# EAGLE board motherboard (EAGLE 5.10), part 1 of 3
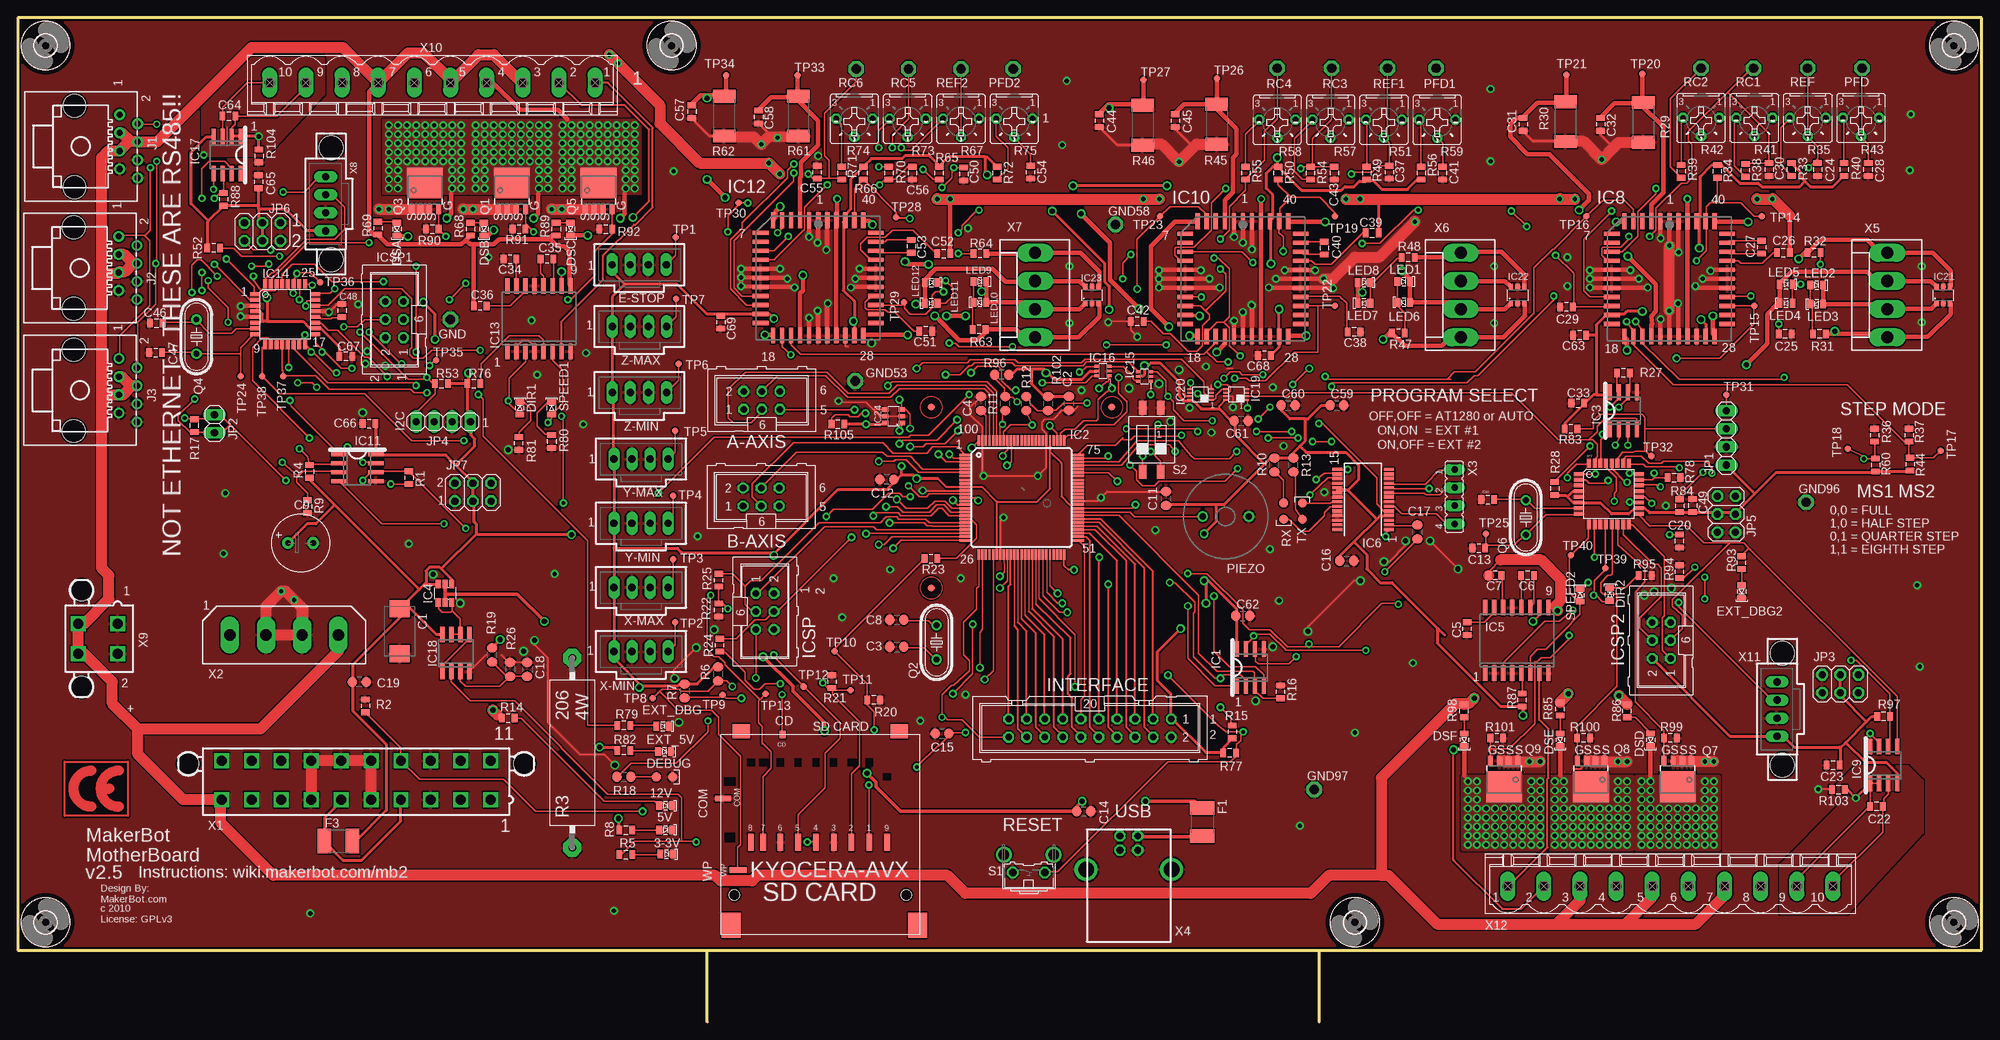
[diagram p7: board, top side]
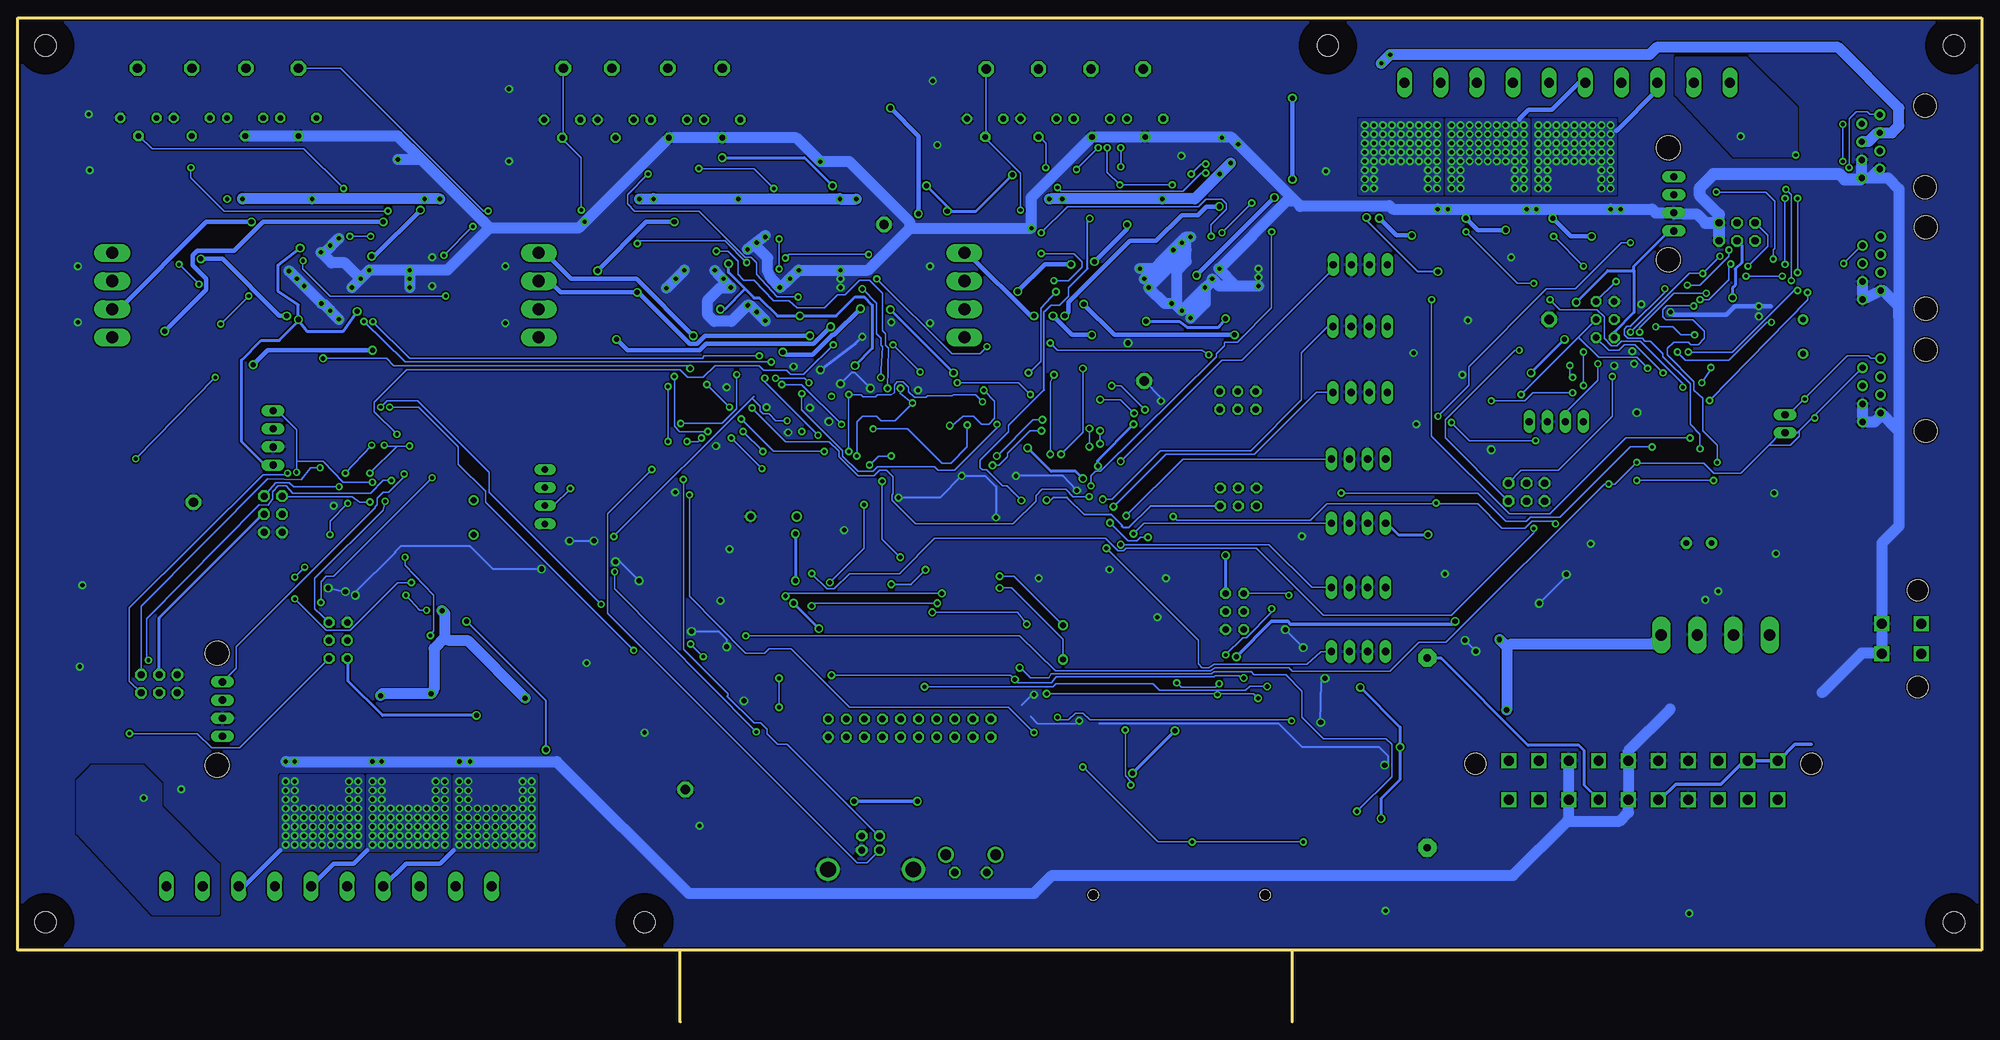
[diagram p8: board, bottom side, seen from below]

Size 276 x 141.1 mm. Coordinates in mm from the lower left corner, seen from the top.
Outline: 96.9,0 96.9,10
Outline: 182.9,0 182.9,10
Outline: 0,10.1 276,10.1 276,141.1 0,141.1 0,10.1
Copper layers (1*16): Top 0.035mm / dielectric 1.5mm / Bottom 0.035mm
Design rules "SparkFun *": minimum track width 8mil, minimum drill 20mil, track to track 8mil, track to pad 6mil, pad to pad 6mil, via to via 8mil, smd to smd 6mil, copper to edge 10mil, drill to drill 8mil, minimum pad ring 12mil, minimum via ring 10mil, stop-mask expansion 4mil, vias tented up to drill 25mil, thermal gap 10mil
Net classes: 0 default: width 0.152 mm, drill 0.406 mm, clearance 0.203 mm; 1 power: width 0.61 mm, drill 0.711 mm, clearance 0.203 mm; 2 gnd: width 0.305 mm, drill 0.711 mm, clearance 0.203 mm; 3 usbvcc: width 0.508 mm, drill 0.711 mm, clearance 0.203 mm; 4 5V_power: width 0.406 mm, drill 0.711 mm, clearance 0.203 mm; 5 12V_power: width 1.524 mm, drill 0.711 mm, clearance 0.203 mm

## Footprints (pad centres in the part's own frame; a part is rotated, then mirrored left to right if it is on the bottom)
LED-0805 = smd 1.2 x 0.8: A 0,-0.9; C 0,0.9
ML6 = drill 0.914 octagon: 1 -2.54,-1.27; 2 -2.54,1.27; 3 0,-1.27; 4 0,1.27; 5 2.54,-1.27; 6 2.54,1.27
SMC_D = smd 2.4 x 2.8: + -3.15,0; - 3.15,0
C0805RND = smd 1.3 x 1.5: 1 -0.977,0; 2 0.977,0
0805 = smd 0.8 x 1.2: 1 -0.9,0; 2 0.9,0
E3,5-8 = drill 0.813 pad 1.6 round: + -1.778,0 | drill 0.813 pad 1.6 octagon: - 1.778,0
0805RND = smd 1.27 x 1.27: P$1 -1.143,0; P$2 1.143,0
70543-04 = drill 1.016 long: 1 -3.81,0; 2 -1.27,0; 3 1.27,0; 4 3.81,0
L1812 = smd 1.9 x 3.4: 1 -1.95,0; 2 1.95,0
P1-13 = drill 1.321 pad 2.159 octagon: TP 0,0
SO08 = smd 0.6 x 2.2: 1 -1.905,-2.6; 2 -0.635,-2.6; 3 0.635,-2.6; 4 1.905,-2.6; 5 1.905,2.6; 6 0.635,2.6; 7 -0.635,2.6; 8 -1.905,2.6
TQFP100 = smd 1.5 x 0.35: 1 -8,6; 2 -8,5.5; 3 -8,5; 4 -8,4.5; 5 -8,4; 6 -8,3.5; 7 -8,3; 8 -8,2.5; 9 -8,2; 10 -8,1.5; 11 -8,1; 12 -8,0.5; 13 -8,0; 14 -8,-0.5; 15 -8,-1; 16 -8,-1.5; 17 -8,-2; 18 -8,-2.5; 19 -8,-3; 20 -8,-3.5; 21 -8,-4; 22 -8,-4.5; 23 -8,-5; 24 -8,-5.5; 25 -8,-6; 51 8,-6; 52 8,-5.5; 53 8,-5; 54 8,-4.5; 55 8,-4; 56 8,-3.5; 57 8,-3; 58 8,-2.5; 59 8,-2; 60 8,-1.5; 61 8,-1; 62 8,-0.5; 63 8,0; 64 8,0.5; 65 8,1; 66 8,1.5; 67 8,2; 68 8,2.5; 69 8,3; 70 8,3.5; 71 8,4; 72 8,4.5; 73 8,5; 74 8,5.5; 75 8,6 | smd 0.35 x 1.5: 26 -6,-8; 27 -5.5,-8; 28 -5,-8; 29 -4.5,-8; 30 -4,-8; 31 -3.5,-8; 32 -3,-8; 33 -2.5,-8; 34 -2,-8; 35 -1.5,-8; 36 -1,-8; 37 -0.5,-8; 38 0,-8; 39 0.5,-8; 40 1,-8; 41 1.5,-8; 42 2,-8; 43 2.5,-8; 44 3,-8; 45 3.5,-8; 46 4,-8; 47 4.5,-8; 48 5,-8; 49 5.5,-8; 50 6,-8; 76 6,8; 77 5.5,8; 78 5,8; 79 4.5,8; 80 4,8; 81 3.5,8; 82 3,8; 83 2.5,8; 84 2,8; 85 1.5,8; 86 1,8; 87 0.5,8; 88 0,8; 89 -0.5,8; 90 -1,8; 91 -1.5,8; 92 -2,8; 93 -2.5,8; 94 -3,8; 95 -3.5,8; 96 -4,8; 97 -4.5,8; 98 -5,8; 99 -5.5,8; 100 -6,8
FDC6304 = smd 0.7 x 1.2: 1 -0.95,-1.3; 2 0,-1.3; 3 0.95,-1.3; 4 0.95,1.3; 5 0,1.3; 6 -0.95,1.3
SO16W = smd 0.6 x 2.2: 1 -4.445,-4.6; 2 -3.175,-4.6; 3 -1.905,-4.6; 4 -0.635,-4.6; 5 0.635,-4.6; 6 1.905,-4.6; 7 3.175,-4.6; 8 4.445,-4.6; 9 4.445,4.6; 10 3.175,4.6; 11 1.905,4.6; 12 0.635,4.6; 13 -0.635,4.6; 14 -1.905,4.6; 15 -3.175,4.6; 16 -4.445,4.6
SSOP28 = smd 0.381 x 1.499: 1 -4.225,-3.625; 2 -3.575,-3.625; 3 -2.925,-3.625; 4 -2.275,-3.625; 5 -1.625,-3.625; 6 -0.975,-3.625; 7 -0.325,-3.625; 8 0.325,-3.625; 9 0.975,-3.625; 10 1.625,-3.625; 11 2.275,-3.625; 12 2.925,-3.625; 13 3.575,-3.625; 14 4.225,-3.625; 15 4.225,3.625; 16 3.575,3.625; 17 2.925,3.625; 18 2.275,3.625; 19 1.625,3.625; 20 0.975,3.625; 21 0.325,3.625; 22 -0.325,3.625; 23 -0.975,3.625; 24 -1.625,3.625; 25 -2.275,3.625; 26 -2.925,3.625; 27 -3.575,3.625; 28 -4.225,3.625
TQFP32-08 = smd 1.27 x 0.559: 1 -4.293,2.8; 2 -4.293,2; 3 -4.293,1.2; 4 -4.293,0.4; 5 -4.293,-0.4; 6 -4.293,-1.2; 7 -4.293,-2; 8 -4.293,-2.8; 17 4.293,-2.8; 18 4.293,-2; 19 4.293,-1.2; 20 4.293,-0.4; 21 4.293,0.4; 22 4.293,1.2; 23 4.293,2; 24 4.293,2.8 | smd 0.559 x 1.27: 9 -2.8,-4.293; 10 -2,-4.293; 11 -1.2,-4.293; 12 -0.4,-4.293; 13 0.4,-4.293; 14 1.2,-4.293; 15 2,-4.293; 16 2.8,-4.293; 25 2.8,4.293; 26 2,4.293; 27 1.2,4.293; 28 0.4,4.293; 29 -0.4,4.293; 30 -1.2,4.293; 31 -2,4.293; 32 -2.8,4.293
PLCC44 = smd 0.6 x 2.2: 1 0,8.1; 2 -1.27,8.1; 3 -2.54,8.1; 4 -3.81,8.1; 5 -5.08,8.1; 6 -6.35,8.1; 18 -6.35,-8.1; 19 -5.08,-8.1; 20 -3.81,-8.1; 21 -2.54,-8.1; 22 -1.27,-8.1; 23 0,-8.1; 24 1.27,-8.1; 25 2.54,-8.1; 26 3.81,-8.1; 27 5.08,-8.1; 28 6.35,-8.1; 40 6.35,8.1; 41 5.08,8.1; 42 3.81,8.1; 43 2.54,8.1; 44 1.27,8.1 | smd 2.2 x 0.6: 7 -8.1,6.35; 8 -8.1,5.08; 9 -8.1,3.81; 10 -8.1,2.54; 11 -8.1,1.27; 12 -8.1,0; 13 -8.1,-1.27; 14 -8.1,-2.54; 15 -8.1,-3.81; 16 -8.1,-5.08; 17 -8.1,-6.35; 29 8.1,-6.35; 30 8.1,-5.08; 31 8.1,-3.81; 32 8.1,-2.54; 33 8.1,-1.27; 34 8.1,0; 35 8.1,1.27; 36 8.1,2.54; 37 8.1,3.81; 38 8.1,5.08; 39 8.1,6.35
SC70-6 = smd 0.4 x 0.7: 1 -0.65,-0.85; 2 0,-0.85; 3 0.65,-0.85; 4 0.65,0.85; 5 0,0.85; 6 -0.65,0.85
DCU_R-PDSO-G8 = smd 0.3 x 0.6: 1 -0.75,-1.5; 2 -0.25,-1.5; 3 0.25,-1.5; 4 0.75,-1.5; 5 0.75,1.5; 6 0.25,1.5; 7 -0.25,1.5; 8 -0.75,1.5
SOT23-6 = smd 0.6 x 0.9: 1 -0.95,-1.15; 2 0,-1.15; 3 0.95,-1.15; 4 0.95,1.15; 5 0,1.15; 6 -0.95,1.15
ML20 = drill 0.914 octagon: 1 -11.43,-1.27; 2 -11.43,1.27; 3 -8.89,-1.27; 4 -8.89,1.27; 5 -6.35,-1.27; 6 -6.35,1.27; 7 -3.81,-1.27; 8 -3.81,1.27; 9 -1.27,-1.27; 10 -1.27,1.27; 11 1.27,-1.27; 12 1.27,1.27; 13 3.81,-1.27; 14 3.81,1.27; 15 6.35,-1.27; 16 6.35,1.27; 17 8.89,-1.27; 18 8.89,1.27; 19 11.43,-1.27; 20 11.43,1.27
556416-1 = drill 0.889 round: 1 -4.445,5.461; 2 -3.175,8.001; 3 -1.905,5.461; 4 -0.635,8.001; 5 0.635,5.461; 6 1.905,8.001; 7 3.175,5.461; 8 4.445,8.001 | hole 3.251: -5.715,-0.889; 5.715,-0.889
KYOCERA-SDCARD = smd 0.8 x 2.4: 1 -6.88,1.2; 2 -4.38,1.2; 3 -1.88,1.2; 4 0.62,1.2; 5 3.12,1.2; 6 5.62,1.2; 7 8.05,1.2; 8 9.75,1.2; 9 -9.38,1.2 | smd 0.8 x 1.05: CD 5.3,-13.9 | smd 2.7 x 3.5: CGND1 12.55,12.85; CGND2 -13.65,12.85 | smd 2.4 x 2: CGND3 -11.1,-14.4; CGND4 11.1,-14.4 | smd 2.25 x 0.8: COM 13.68,-4.95 | smd 2.4 x 0.8: WP 11.573,5.1 | hole 1.5: 12.1,8.6; -12.1,8.6
1X04 = drill 1.016 long: 1 -3.81,0; 2 -1.27,0; 3 1.27,0; 4 3.81,0
1X02 = drill 1.016 long: 1 -1.27,0; 2 1.27,0
2X03 = drill 1.016 octagon: 1 -2.54,-1.27; 2 -2.54,1.27; 3 0,-1.27; 4 0,1.27; 5 2.54,-1.27; 6 2.54,1.27
BUZZER-12MM-NS = drill 0.9 round: + 3.25,0; - -3.25,0
SOT669 = smd 0.7 x 1.4: 1 -1.905,-2.65; 2 -0.635,-2.65; 3 0.635,-2.65; 4 1.905,-2.65 | smd 5 x 4.3: MB 0,1
HC49/S = drill 0.813 round: 1 -2.413,0; 2 2.413,0
KH206-8 = drill 1.016 pad 2.54 octagon: 1 -13.335,0; 2 13.335,0
R0805RND = smd 1.3 x 1.5: 1 -0.977,0; 2 0.977,0
R2512 = smd 1.8 x 3.2: 1 -2.8,0; 2 2.8,0
B25P = drill 0.813 octagon: A -2.54,0; E 2.54,0; S 0,2.54
B3F-31XX = drill 1.016 octagon: 1 -2.261,-1.245; 2 2.261,-1.245 | drill 1.499 pad 2.159 round: 3 -3.505,1.245; 4 3.505,1.245
SMS-002 = smd 1.092 x 2.007: 1 -1.27,-4.496; 2 1.27,-4.496; 3 1.27,4.496; 4 -1.27,4.496
TP09R = smd 0.9 x 0.9: TP 0,0
3,0 = hole 3: 0,0
FIDUCIA-MOUNT = smd 1.016 x 1.016: P$1 0,0
5566-20 = drill 1.4 square: 1 18.9,-2.75; 2 14.7,-2.75; 3 10.5,-2.75; 4 6.3,-2.75; 5 2.1,-2.75; 6 -2.1,-2.75; 7 -6.3,-2.75; 8 -10.5,-2.75; 9 -14.7,-2.75; 10 -18.9,-2.75; 11 18.9,2.75; 12 14.7,2.75; 13 10.5,2.75; 14 6.3,2.75; 15 2.1,2.75; 16 -2.1,2.75; 17 -6.3,2.75; 18 -10.5,2.75; 19 -14.7,2.75; 20 -18.9,2.75 | hole 3: 23.6,2.29; -23.6,2.29
9090-4V = drill 1.6 pad 2.6 long: 1 -7.62,0; 2 -2.54,0; 3 2.54,0; 4 7.62,0
JP4 = drill 0.914 long: 1 -3.81,0; 2 -1.27,0; 3 1.27,0; 4 3.81,0
PN61729 = drill 0.95 octagon: 1 1.25,4.71; 2 -1.25,4.71; 3 -1.25,2.71; 4 1.25,2.71 | drill 2.2 round: P$1 -6,0; P$2 6,0
KK-156-4 = drill 1.7 pad 2.184 long: 1 -5.94,0; 2 -1.98,0; 3 1.98,0; 4 5.94,0
70543-04' = drill 1.016 long: 1 -3.81,0; 2 -1.27,0; 3 1.27,0; 4 3.81,0 | hole 3.404: -7.874,-0.762; 7.874,-0.762
5566-4 = drill 1.4 square: 1 2.1,-2.75; 2 -2.1,-2.75; 3 2.1,2.75; 4 -2.1,2.75 | hole 3: 6.8,2.29; -6.8,2.29
MSTBV10 = drill 1.397 long: 1 -22.86,0; 2 -17.78,0; 3 -12.7,0; 4 -7.62,0; 5 -2.54,0; 6 2.54,0; 7 7.62,0; 8 12.7,0; 9 17.78,0; 10 22.86,0

## Placement (x,y rotation side)
3-3V  [LED-0805]  91.18,23.59 270 top
5V  [LED-0805]  91.04,27.01 270 top
12V  [LED-0805]  91.04,30.41 270 top
A-AXIS  [ML6]  104.56,87.35 0 top
B-AXIS  [ML6]  104.47,73.77 0 top
C1  100u  [SMC_D]  53.68,54.89 270 top
C2  100n  [C0805RND]  147.71,86.95 270 top
C3  22p  [C0805RND]  123.53,52.71 0 top
C4  100n  [C0805RND]  135.34,86.9 90 top
C5  .22uF  [0805]  203.67,55.27 90 top
C6  100nF  [0805]  212.18,62.77 180 top
C7  100nF  [0805]  207.61,62.77 180 top
C8  22p  [C0805RND]  123.53,56.52 0 top
C9  100uF  [E3,5-8]  39.74,67.31 0 top
C10  16pf  [0805]  206.59,73.44 0 top
C11  100n  [C0805RND]  161.38,73.56 90 top
C12  100n  [C0805RND]  122.14,76.23 180 top
C13  16pf  [0805]  205.32,66.58 0 top
C14  100n  [C0805RND]  149.82,29.62 0 top
C15  100n  [C0805RND]  129.88,40.54 0 top
C16  100n  [C0805RND]  186.78,64.8 0 top
C17  100n  [C0805RND]  196.69,68.86 270 top
C18  100n  [C0805RND]  71.59,49.56 270 top
C19  100n  [C0805RND]  47.99,47.78 180 top
C20  100nF  [0805]  233.52,67.59 90 top
C22  100nF  [0805]  261.2,30.26 180 top
C23  100nF  [0805]  255.11,36.1 0 top
C24  100nF  [0805]  252.95,119.79 270 top
C25  220nF  [0805]  248.38,96.68 180 top
C26  220nF  [0805]  248.12,108.11 0 top
C27  220nF  [0805]  245.07,108.87 270 top
C28  100nF  [0805]  260.06,119.79 90 top
C29  470pF  [0805]  217.64,100.49 180 top
C30  470pF  [0805]  246.09,119.79 270 top
C31  1uF  [0805]  211.55,126.14 270 top
C32  1uF  [0805]  222.47,126.14 270 top
C33  100nF  [0805]  219.24,86.95 0 top
C34  .22uF  [0805]  69.18,107.22 0 top
C35  100nF  [0805]  74.39,107.22 180 top
C36  100nF  [0805]  64.99,100.61 180 top
C37  100nF  [0805]  192.75,119.41 270 top
C38  220nF  [0805]  187.8,96.93 180 top
C39  220nF  [0805]  190.34,110.9 0 top
C40  220nF  [0805]  183.61,108.74 270 top
C41  100nF  [0805]  200.24,119.28 90 top
C42  470pF  [0805]  157.32,98.45 180 top
C43  470pF  [0805]  185,119.28 270 top
C44  1uF  [0805]  151.98,126.65 270 top
C45  1uF  [0805]  162.65,126.65 270 top
C46  16pf  [0805]  19.47,98.23 0 top
C47  16pf  [0805]  19.37,94.06 0 top
C48  100nF  [0805]  45.56,99.98 270 top
C49  100nF  [0805]  235.34,72.57 270 top
C50  100nF  [0805]  132.93,119.16 270 top
C51  220nF  [0805]  127.6,97.06 180 top
C52  220nF  [0805]  130.14,107.98 0 top
C53  220nF  [0805]  125.57,109 270 top
C54  100nF  [0805]  142.33,119.41 90 top
C55  470pF  [0805]  112.36,119.41 90 top
C56  470pF  [0805]  125.69,119.28 270 top
C57  1uF  [0805]  94.71,127.92 270 top
C58  1uF  [0805]  104.1,127.16 270 top
C59  100n  [C0805RND]  185.38,86.64 0 top
C60  100n  [C0805RND]  178.53,86.64 0 top
C61  100n  [C0805RND]  171.92,84.48 0 top
C62  100n  [C0805RND]  172.15,57.08 0 top
C63  100nF  [0805]  219.5,96.5 180 top
C64  100nF  [0805]  29.68,127.28 0 top
C65  100nF  [0805]  33.85,118.06 270 top
C66  100nF  [0805]  49.37,84.1 0 top
C67  100nF  [0805]  46.11,93.5 180 top
C68  100nF  [0805]  175.2,93.65 180 top
C69  100nF  [0805]  98.79,98.33 270 top
DEBUG  [0805RND]  90.9,34.45 0 top
DIR1  [LED-0805]  70.58,86.26 0 top
DIR2  [LED-0805]  223.74,60.1 0 top
DSA  [LED-0805]  53.3,111.41 180 top
DSB  [LED-0805]  65.5,111.41 180 top
DSC  [LED-0805]  77.69,111.41 180 top
DSD  [LED-0805]  229.45,39.65 180 top
DSE  [LED-0805]  216.75,39.65 180 top
DSF  [LED-0805]  203.29,39.65 180 top
E-STOP  C-GRID-04-70543  [70543-04]  87.33,106.41 0 top
EXT_5V  [LED-0805]  90.9,38 270 top
EXT_DBG  [LED-0805]  90.64,41.56 270 top
EXT_DBG2  [LED-0805]  242.28,60.48 180 top
F1  500mA  [L1812]  166.46,28.1 270 top
F3  500mA  [L1812]  45.05,25.43 0 top
GND  TPPAD1-13  [P1-13]  60.8,98.71 0 top
GND53  TPPAD1-13  [P1-13]  117.69,90.07 0 top
GND58  TPPAD1-13  [P1-13]  154.27,112.04 0 top
GND96  TPPAD1-13  [P1-13]  251.3,73.03 0 top
GND97  TPPAD1-13  [P1-13]  182.21,32.69 0 top
IC1  SN75176ASOIC  [SO08]  173.24,49.8 0 top
IC2  ATMEGA1280-16AU  [TQFP100]  141.06,73.69 0 top
IC3  SN75176ASOIC  [SO08]  225.64,85.88 0 top
IC4  [FDC6304]  60.03,60.23 0 top
IC5  A3949  [SO16W]  210.66,53.62 0 top
IC6  FT232RL  [SSOP28]  189.07,73.44 90 top
IC7  ATMEGA328  [TQFP32-08]  223.61,74.2 0 top
IC8  A3977  [PLCC44]  232.12,104.42 0 top
IC9  MAX6675  [SO08]  262.22,36.1 0 top
IC10  A3977  [PLCC44]  172.18,104.42 0 top
IC11  SN75176ASOIC  [SO08]  47.71,77.88 270 top
IC12  A3977  [PLCC44]  112.48,104.55 0 top
IC13  A3949  [SO16W]  73.24,98.84 0 top
IC14  ATMEGA328  [TQFP32-08]  37.55,99.47 0 top
IC15  741G19  [SC70-6]  158.33,90.71 90 top
IC16  741G19  [SC70-6]  152.49,91.47 90 top
IC17  MAX6675  [SO08]  29.43,121.82 180 top
IC18  LM358MX  [SO08]  61.56,51.85 0 top
IC19  74LVC2G157  [DCU_R-PDSO-G8]  171.24,88.17 90 top
IC20  74LVC2G157  [DCU_R-PDSO-G8]  166.21,88.17 90 top
IC21  TVS-DIODE-ARRAY  [SOT23-6]  270.6,102.14 0 top
IC22  TVS-DIODE-ARRAY  [SOT23-6]  210.78,102.14 0 top
IC23  TVS-DIODE-ARRAY  [SOT23-6]  150.97,102.14 0 top
IC24  24LC014  [SOT23-6]  123.08,85.12 90 top
ICSP  [ML6]  104.99,57.69 270 top
ICSP1  [ML6]  52.92,98.71 90 top
ICSP2  [ML6]  230.98,53.62 90 top
INTERFACE  [ML20]  150.67,41.31 180 top
J1  [556416-1]  8.85,123.04 270 top
J2  [556416-1]  8.73,105.95 270 top
J3  [556416-1]  8.74,88.76 270 top
J4  SDCARD-AVX  [KYOCERA-SDCARD]  112.78,26.47 180 top
JP1  [1X04]  240.12,82.07 90 top
JP2  [1X02]  27.64,84.06 270 top
JP3  [2X03]  256.12,47.53 0 top
JP4  [1X04]  59.78,84.36 180 top
JP5  [2X03]  240.12,71.35 90 top
JP6  [2X03]  34.38,111.03 180 top
JP7  [2X03]  63.97,74.45 0 top
LED1  A  [LED-0805]  194.78,104.04 270 top
LED2  A  [LED-0805]  252.82,103.53 270 top
LED3  B  [LED-0805]  252.82,100.87 90 top
LED4  C  [LED-0805]  248.5,101 90 top
LED5  D  [LED-0805]  248.5,103.66 270 top
LED6  B  [LED-0805]  194.78,101.12 90 top
LED7  C  [LED-0805]  189.19,101 90 top
LED8  D  [LED-0805]  189.19,103.92 270 top
LED9  A  [LED-0805]  135.22,104.04 270 top
LED10  B  [LED-0805]  135.22,101.12 90 top
LED11  C  [LED-0805]  128.36,101 90 top
LED12  D  [LED-0805]  128.36,103.92 270 top
PFD  TPPAD1-13  [P1-13]  259.17,134.01 180 top
PFD1  TPPAD1-13  [P1-13]  199.35,134.01 0 top
PFD2  TPPAD1-13  [P1-13]  139.92,133.89 180 top
PIEZO  BUZZERNS  [BUZZER-12MM-NS]  169.76,71.02 180 top
Q1  PH7030L  [SOT669]  69.43,116.87 0 top
Q2  16MHz  [HC49/S]  129.12,53.34 90 top
Q3  PH7030L  [SOT669]  57.24,116.87 0 top
Q4  16MHZ  [HC49/S]  25.11,96.3 90 top
Q5  PH7030L  [SOT669]  81.62,116.87 0 top
Q6  16MHZ  [HC49/S]  211.93,70.9 90 top
Q7  PH7030L  [SOT669]  233.26,34.07 180 top
Q8  PH7030L  [SOT669]  221.07,34.07 180 top
Q9  PH7030L  [SOT669]  208.88,34.07 180 top
R1  180  [0805]  54.95,76.48 270 top
R2  1K  [0805]  48.85,44.43 270 top
R3  30  [KH206-8]  77.93,37.83 90 top
R4  4.7k  [0805]  40.98,77.37 270 top
R5  1K  [0805]  85.45,23.57 0 top
R6  10k  [R0805RND]  98.39,48.92 270 top
R7  10k  [R0805RND]  93.69,46.51 270 top
R8  1K  [0805]  85.43,26.95 0 top
R9  4.7k  [0805]  40.73,72.42 270 top
R10  1k  [R0805RND]  176.62,78.26 90 top
R11  1K  [R0805RND]  138.77,86.9 90 top
R12  1K  [R0805RND]  141.72,86.9 90 top
R13  1k  [R0805RND]  179.29,78.26 90 top
R14  2.2K  [0805]  68.92,42.7 0 top
R15  10K  [0805]  170.7,40.79 270 top
R16  10K  [0805]  177.46,46.4 90 top
R17  180  [0805]  24.84,83.8 90 top
R18  1K  [R0805RND]  85.18,34.45 0 top
R19  10k  [R0805RND]  66.64,51.59 90 top
R20  3.3K  [0805]  120.28,45.23 180 top
R21  3.3K  [0805]  114.4,47.83 270 top
R22  3.3K  [0805]  98.5,57.9 90 top
R23  1.8K  [0805]  128.34,65.12 0 top
R24  1.8K  [0805]  98.63,52.94 90 top
R25  1.8K  [0805]  98.5,62.09 90 top
R26  10k  [R0805RND]  69.18,49.56 270 top
R27  180  [0805]  225.64,91.22 180 top
R28  4.7k  [0805]  215.99,74.96 270 top
R29  0.25  [R2512]  228.44,126.39 270 top
R30  0.25  [R2512]  217.51,126.52 270 top
R31  1K  [0805]  253.2,96.68 180 top
R32  1K  [0805]  252.44,108.11 0 top
R33  12K  [0805]  249.26,119.79 90 top
R34  1K  [0805]  238.85,119.54 90 top
R35  47K  [B25P]  251.55,127.03 180 top
R36  10K  [0805]  260.95,82.45 270 top
R37  10K  [0805]  265.77,82.45 270 top
R38  12K  [0805]  242.79,119.66 90 top
R39  12K  [0805]  233.77,119.54 270 top
R40  12K  [0805]  256.63,119.79 270 top
R41  47K  [B25P]  244.06,127.03 180 top
R42  47K  [B25P]  236.56,127.03 180 top
R43  47K  [B25P]  259.04,127.03 180 top
R44  0  [0805]  265.9,78.39 270 top
R45  0.25  [R2512]  168.49,126.14 270 top
R46  0.25  [R2512]  158.08,126.01 270 top
R47  1K  [0805]  194.02,96.8 0 top
R48  1K  [0805]  195.39,107.42 180 top
R49  12K  [0805]  189.57,119.28 270 top
R50  1K  [0805]  177.13,119.28 90 top
R51  47K  [B25P]  191.99,126.78 180 top
R52  4.7K  [0805]  27.52,108.74 180 top
R53  4.7K  [0805]  59.53,89.69 0 top
R54  12K  [0805]  181.7,119.28 90 top
R55  12K  [0805]  172.56,119.28 270 top
R56  12K  [0805]  197.19,119.28 270 top
R57  47K  [B25P]  184.49,126.78 180 top
R58  47K  [B25P]  177,126.78 180 top
R59  47K  [B25P]  199.48,126.78 180 top
R60  0  [0805]  261.07,78.26 270 top
R61  0.25  [R2512]  109.69,127.28 270 top
R62  0.25  [R2512]  99.28,127.28 270 top
R63  1K  [0805]  135.09,97.31 180 top
R64  1K  [0805]  135.22,107.98 180 top
R65  12K  [0805]  129.5,119.28 90 top
R66  1K  [0805]  118.84,119.28 90 top
R67  47K  [B25P]  132.55,126.9 180 top
R68  1K  [0805]  63.59,111.41 270 top
R69  1K  [0805]  50.64,111.54 270 top
R70  12K  [0805]  122.39,119.28 270 top
R71  12K  [0805]  115.79,119.28 270 top
R72  12K  [0805]  137.63,119.28 90 top
R73  47K  [B25P]  125.06,126.9 180 top
R74  47K  [B25P]  117.57,126.9 180 top
R75  47K  [B25P]  140.04,126.9 180 top
R76  10K  [0805]  64.1,89.69 0 top
R77  1K  [0805]  170.32,37.83 180 top
R78  4.7k  [0805]  232.75,76.48 0 top
R79  1K  [0805]  85.18,41.69 180 top
R80  1K  [0805]  75.02,81.56 270 top
R81  1K  [0805]  70.45,81.31 90 top
R82  1K  [0805]  85.18,38.13 180 top
R83  4.7K  [0805]  218.28,83.34 180 top
R84  4.7K  [0805]  233.52,72.55 270 top
R85  1K  [0805]  216.75,43.97 90 top
R86  1K  [0805]  226.15,43.72 90 top
R87  10K  [0805]  211.42,45.24 90 top
R88  10K  [0805]  28.92,115.6 270 top
R89  1K  [0805]  75.66,111.41 270 top
R90  4.7K  [0805]  58.26,111.41 0 top
R91  4.7K  [0805]  70.45,111.41 0 top
R92  4.7K  [0805]  82.64,111.41 0 top
R93  1K  [0805]  242.28,64.55 90 top
R94  1K  [0805]  233.52,63.28 90 top
R95  1K  [0805]  228.69,62.77 180 top
R96  10k  [R0805RND]  138.27,90.96 180 top
R97  10K  [0805]  262.22,42.96 180 top
R98  1K  [0805]  203.29,43.72 90 top
R99  4.7K  [0805]  232.25,39.91 180 top
R100  4.7K  [0805]  220.05,39.91 180 top
R101  4.7K  [0805]  207.86,39.91 180 top
R102  10k  [R0805RND]  144.77,86.9 270 top
R103  0  [0805]  255.87,32.69 0 top
R104  0  [0805]  33.87,121.7 270 top
R105  1.8K  [0805]  115.25,84 0 top
RC1  TPPAD1-13  [P1-13]  243.93,134.01 180 top
RC2  TPPAD1-13  [P1-13]  236.56,134.01 180 top
RC3  TPPAD1-13  [P1-13]  184.62,134.01 0 top
RC4  TPPAD1-13  [P1-13]  177,134.01 0 top
RC5  TPPAD1-13  [P1-13]  125.19,133.89 180 top
RC6  TPPAD1-13  [P1-13]  117.82,133.89 180 top
REF  TPPAD1-13  [P1-13]  251.55,134.01 180 top
REF1  TPPAD1-13  [P1-13]  192.5,134.01 0 top
REF2  TPPAD1-13  [P1-13]  132.55,133.89 180 top
RX  [0805RND]  177.89,71.78 270 top
S1  [B3F-31XX]  142.08,22.26 0 top
S2  SWS002  [SMS-002]  159.35,81.82 180 top
SPEED1  1  [LED-0805]  75.02,86.26 0 top
SPEED2  1  [LED-0805]  219.55,59.97 0 top
TP1  TPSQTP09R  [TP09R]  92.47,110.25 0 top
TP2  TPSQTP09R  [TP09R]  92.34,56.15 180 top
TP3  TPSQTP09R  [TP09R]  92.08,65.04 180 top
TP4  TPSQTP09R  [TP09R]  92.08,73.93 180 top
TP5  TPSQTP09R  [TP09R]  92.34,83.08 180 top
TP6  TPSQTP09R  [TP09R]  92.85,92.47 180 top
TP7  TPSQTP09R  [TP09R]  92.5,101.64 0 top
TP8  TPSQTP09R  [TP09R]  89.18,45.48 90 top
TP9  TPSQTP09R  [TP09R]  99.02,46 180 top
TP10  TPSQTP09R  [TP09R]  114.77,52.1 0 top
TP11  TPSQTP09R  [TP09R]  117.06,46.64 0 top
TP12  TPSQTP09R  [TP09R]  110.45,47.15 180 top
TP13  TPSQTP09R  [TP09R]  105.12,46.13 180 top
TP14  PTR1TP09R  [TP09R]  245.07,113.19 90 top
TP15  PTR1TP09R  [TP09R]  244.06,100.61 90 top
TP16  PTR1TP09R  [TP09R]  220.44,113.19 180 top
TP17  PTR1TP09R  [TP09R]  270.22,80.29 90 top
TP18  PTR1TP09R  [TP09R]  257.16,80.57 90 top
TP19  PTR1TP09R  [TP09R]  185.13,113.19 180 top
TP20  PTR1TP09R  [TP09R]  228.31,133.25 0 top
TP21  PTR1TP09R  [TP09R]  217.64,133.13 90 top
TP22  PTR1TP09R  [TP09R]  185.13,100.61 90 top
TP23  PTR1TP09R  [TP09R]  160.49,113.19 180 top
TP24  PTR1TP09R  [TP09R]  31.33,90.71 180 top
TP25  PTR1TP09R  [TP09R]  206.34,68.61 90 top
TP26  PTR1TP09R  [TP09R]  168.49,132.62 0 top
TP27  PTR1TP09R  [TP09R]  158.21,132.36 0 top
TP28  PTR1TP09R  [TP09R]  123.41,113.06 0 top
TP29  PTR1TP09R  [TP09R]  124.55,101.12 90 top
TP30  PTR1TP09R  [TP09R]  101.31,115.09 180 top
TP31  PTR1TP09R  [TP09R]  240.12,88.17 0 top
TP32  PTR1TP09R  [TP09R]  229.58,79.53 0 top
TP33  PTR1TP09R  [TP09R]  109.56,133 0 top
TP34  PTR1TP09R  [TP09R]  99.53,133 180 top
TP35  PTR1TP09R  [TP09R]  58.76,92.99 0 top
TP36  PTR1TP09R  [TP09R]  42.51,103.92 0 top
TP37  PTR1TP09R  [TP09R]  37.3,90.71 0 top
TP38  PTR1TP09R  [TP09R]  34.38,90.71 0 top
TP39  PTR1TP09R  [TP09R]  223.1,63.78 0 top
TP40  PTR1TP09R  [TP09R]  218.28,65.56 0 top
TX  [0805RND]  180.53,71.78 90 top
U$1  [3,0]  187.9,14 0 top
U$3  FIDUCIALMOUNT  [FIDUCIA-MOUNT]  128.36,60.99 0 top
U$4  [3,0]  3.9,137.2 0 top
U$5  [3,0]  272.1,137.2 0 top
U$6  [3,0]  272.1,14 0 top
U$7  [3,0]  3.9,14 0 top
U$8  FIDUCIALMOUNT  [FIDUCIA-MOUNT]  153.76,86.39 0 top
U$9  FIDUCIALMOUNT  [FIDUCIA-MOUNT]  128.36,86.39 0 top
U$10  CE  [CE-COPPER]  6.57,28.99 0 top
U$11  [3,0]  91.9,137.2 0 top
X1  5566-20  [5566-20]  47.54,33.99 0 top
X2  9090-4V  [9090-4V]  37.43,54.39 0 top
X3  [JP4]  201.89,73.82 270 top
X4  [PN61729]  156.14,21.44 0 top
X5  [KK-156-4]  262.73,102.14 90 top
X6  [KK-156-4]  202.78,102.14 90 top
X7  [KK-156-4]  142.97,102.14 90 top
X8  C-GRID-04-70543  [70543-04']  43.27,114.97 90 top
X9  5566-4  [5566-4]  11.27,53.88 90 top
X10  MSTBV10  [MSTBV10]  58.26,131.98 180 top
X11  C-GRID-04-70543  [70543-04']  247.23,43.97 90 top
X12  MSTBV10  [MSTBV10]  232.25,19.08 0 top
X-MAX  C-GRID-04-70543  [70543-04]  87.58,61.07 0 top
X-MIN  C-GRID-04-70543  [70543-04]  87.58,52.05 0 top
Y-MAX  C-GRID-04-70543  [70543-04]  87.58,79.11 0 top
Y-MIN  C-GRID-04-70543  [70543-04]  87.58,70.09 0 top
Z-MAX  C-GRID-04-70543  [70543-04]  87.35,97.74 0 top
Z-MIN  C-GRID-04-70543  [70543-04]  87.35,88.47 0 top

## Tracks (layer width: path | path; a pad name or v marks a point on that pad's centre or on a via)
3V3  (via drill 0.51)
  Top 0.203: 93.31,25.43 86.7,25.43 84.93,23.65 84.67,23.65 R5.1 | 93.31,25.43 95.21,25.43 v95.34,25.3 | IC18.2 60.92,47.78 63.59,45.11 69.81,45.11 82.89,32.03 92.8,32.03 93.31,31.53 93.31,25.43 | v181.6,74.07 184.11,76.48 185.38,76.48 IC6.17 | 131.28,40.67 131.03,40.67 130.9,40.54 C15.2 131.28,40.67 | 131.28,40.67 v133.19,40.67 | 129.44,38.83 129.38,38.77 | 129.44,38.83 131.28,40.67 | v110.96,25.3 112.1,25.3 J4.4 | v126.33,35.84 129.38,38.89 129.44,38.83
  Bottom 0.203: v181.6,74.07 181.6,59.85 173.7,51.85 171.03,51.85 170.4,52.48 167.35,52.48 159.09,44.23 136.74,44.23 v133.19,40.67 | v95.34,25.3 v110.96,25.3 115.79,25.3 v126.33,35.84
+5V  (via drill 0.6 pad 0, 0.71)
  Top 0.305: 129.27,76.38 130.47,75.19 IC2.10 135.5,75.19 137.56,73.13 137.56,73.03 | 137.56,73.03 IC2.31 | IC2.61 147.8,72.69 146.65,73.84 146.65,78.57 145.07,80.14 145.07,81.68 IC2.80 145.07,81.69 145.07,74.96 143.24,73.13 137.66,73.13 137.56,73.03 | 168.87,86.14 168.87,86.56 IC19.8 | IC20.8 165.05,87.42 165.19,87.28 | v134.08,80.67 134.08,80.7 IC2.100
  Top 0.406: v166.08,99.22 164.3,99.22 164.17,99.34 IC10.16 | v177.25,100.16 IC10.27 177.25,94.81 C68.1 | R56.2 197.19,118.39 196.69,118.39 195.29,117 191.73,117 190.46,118.27 189.57,118.27 R49.2 189.45,118.14 188.56,118.14 187.8,117.38 186.53,117.38 186.02,116.87 180.43,116.87 177.25,120.05 R50.2 | R50.2 176.37,120.17 175.48,119.28 175.48,117.12 176.37,116.23 176.37,112.93 175.99,112.55 IC10.42 176.11,112.42 v176.11,106.53 | 158.59,91.98 159.22,92.61 160.49,92.61 163.16,89.95 163.16,88.04 163.79,87.28 165.19,87.28 166.33,86.14 168.87,86.14 170.52,84.48 C61.1 171.03,84.36 171.03,82.58 175.22,78.39 | 158.59,91.98 158.33,91.72 158.33,90.96 158.08,90.71 IC15.5 | 185.51,74.71 185.51,74.96 IC6.19 | 185.51,74.71 185.51,74.45 IC6.20 | 187.8,67.47 185.76,65.44 185.76,64.8 C16.1 | 190.97,70.64 187.8,67.47 | 190.97,70.64 191.48,71.15 192.62,71.15 IC6.4 | 186.91,74.71 185.51,74.71 | 186.91,74.71 190.97,70.64 | R15.2 170.65,39.78 169.51,38.64 169.51,37.88 R77.2 169.25,37.88 166.97,37.88 162.14,42.7 INTERFACE.1 162.02,42.83 162.02,46.13 160.11,48.04 160.11,51.97 v163.41,55.27 | 180.94,84.74 181.32,84.74 183.22,86.64 C59.1 | 180.94,84.74 178.78,84.74 177.64,85.88 177.64,86.64 C60.1 | 168.37,72.67 169.51,72.67 175.22,78.39 | 168.37,72.67 161.38,72.67 C11.1 | 175.22,78.39 175.99,79.15 176.62,79.15 R10.2 176.75,79.28 179.29,79.28 R13.2 178.91,79.41 178.91,79.66 180.18,80.93 | 171.29,57.05 171.29,58.07 167.35,62.01 v166.71,62.01 166.97,61.88 v166.97,58.83 | 171.29,57.05 171.29,52.48 IC1.8 | v166.71,68.61 168.37,70.26 168.37,72.67 | 180.18,80.93 180.94,81.69 180.94,84.74 | 186.91,74.71 188.43,76.23 188.43,78.26 186.65,80.04 181.06,80.04 180.18,80.93
  Top 0.406: 187.8,67.47 189.57,65.69 189.57,63.66 191.48,61.75 193.13,61.75 199.61,55.27 | v158.33,92.23 158.59,91.98 | 220.25,86.96 221.45,88.17 221.83,88.17 | 220.25,86.96 217.39,84.1 R83.2 | 221.83,88.17 223.74,88.17 IC3.8 | 221.83,96.5 221.83,97.95 223.23,99.34 IC8.16 224.12,99.47 225.77,99.47 226.15,99.85 v228.31,99.85 | 221.83,96.5 221.83,88.17 | 251.17,118.14 251.93,117.38 255.11,117.38 256.63,118.9 R40.2 | 251.17,118.14 250.53,118.78 250.53,119.41 R33.2 | 236.18,112.81 235.93,112.55 IC8.42 | 236.18,112.81 236.44,113.06 236.44,118.78 238.09,120.43 238.85,120.43 R34.2 238.98,120.55 239.36,120.55 242.03,117.89 244.56,117.89 245.07,117.38 250.41,117.38 251.17,118.14 | v236.56,98.71 237.2,98.07 IC8.27 | v236.31,108.74 236.31,112.68 236.18,112.81 | JP3.4 JP3.3 256.25,46.13 256.25,45.75 259.81,42.19 | 256.12,38.51 256.12,36.1 C23.2 | 259.81,42.19 260.57,42.96 R97.2 | 256.88,39.27 259.81,42.19 | 256.12,38.51 256.88,39.27 | IC9.4 264.12,34.95 262.6,36.48 259.68,36.48 256.88,39.27 | ICSP2.2 240.63,40.16 X11.1 247.36,40.03 248.25,40.03 249.65,38.64 256,38.64 256.12,38.51 | 217.77,73.82 218.66,72.93 219.29,72.93 IC7.6 219.42,72.93 222.47,72.93 223.99,71.4 226.4,71.4 227.29,72.29 227.8,72.29 IC7.18 227.93,72.17 228.69,72.17 229.33,71.53 233.39,71.53 R84.2 233.52,71.53 235.42,71.53 | 217.77,73.82 217.64,73.94 215.99,73.94 R28.2 | IC7.4 219.29,74.58 218.53,74.58 217.77,73.82 | 235.42,71.53 238.72,71.53 JP5.4 238.98,71.53 241.26,71.53 JP5.3 241.52,71.66 244.12,74.26 | R44.2 265.9,77.37 261.07,77.37 R60.2 260.95,77.25 247.11,77.25 244.12,74.26 | 244.12,74.26 JP1.1 | v211.55,43.08 211.55,44.23 R87.1 211.42,44.35 208.37,44.35 199.48,53.24 199.48,55.15 199.61,55.27
  Top 0.406: 34.38,98.58 34.13,98.33 33.36,98.33 IC14.6 | 34.38,98.58 34.38,99.47 33.87,99.98 33.49,99.98 33.36,99.85 IC14.4 | C67.2 45.17,93.5 45.17,94.9 42.51,97.57 41.87,97.57 IC14.18 41.75,97.57 40.98,97.57 40.09,98.45 35.02,98.45 | 35.02,98.45 34.51,98.45 34.38,98.58 | 33.87,114.2 33.87,112.81 JP6.3 JP6.4 | 33.87,114.2 33.87,114.71 | 33.87,114.71 33.87,117.12 C65.2 | 26.76,112.55 R88.2 29.05,114.71 33.87,114.71 | 26.76,112.55 26.63,112.42 26.63,108.74 R52.2 | IC17.4 27.52,124.36 26.51,124.36 24.35,122.2 24.35,114.97 26.76,112.55 | v35.02,101.76 35.02,98.45 | X8.1 40.73,111.16 37.68,114.2 33.87,114.2 | R76.1 R53.2 | R76.1 63.21,89.56 63.21,84.74 JP4.1 63.72,84.23 63.72,82.45 64.23,81.94 64.23,80.93 61.56,78.26 | C66.2 50.38,84.1 50.38,79.79 IC11.8 50.51,79.66 60.16,79.66 61.56,78.26 | 61.56,78.26 63.97,75.85 JP7.4 JP7.3 64.1,73.06 64.1,70.26 64.48,69.88 64.48,68.61 | 57.37,61.5 57.11,61.5 56.41,60.8 | 57.37,61.5 59.02,61.5 IC4.6 | 56.41,60.8 53.68,58.07 C1.+ | 59.53,63.66 59.27,63.91 57.88,63.91 57.37,63.4 57.37,61.5 | 59.53,63.66 60.92,62.26 60.92,61.62 IC4.4 | 44.54,72.67 40.73,76.48 R4.2 | 56.41,60.8 44.54,72.67 | IC18.8 59.65,54.51 58.76,54.51 54.57,58.7 C1.+ | 44.54,72.67 41.87,70.01 40.66,70.01 C9.+ | 47.08,47.78 47.08,50.2 54.95,58.07 C1.+ | 47.08,47.78 47.08,43.72 51.78,39.02 51.78,29.75 47.46,25.43 F3.2 | 64.48,68.61 59.53,63.66 | v56.99,101.12 58.64,99.47 v58.64,95.92 | v63.34,91.22 63.34,89.82 R76.1 | C2.1 147.66,87.91 144.87,87.91 R102.1 144.62,87.91 144.24,87.91 142.46,89.69 142.46,91.72 | 144.62,91.34 144.24,91.72 142.46,91.72 | 144.62,91.34 145.63,90.33 149.57,90.33 150.71,91.47 IC16.5
  Top 0.406: 142.46,91.72 140.43,91.72 139.66,90.96 R96.1 | 135.98,121.57 136.23,121.57 R72.2 | 135.98,121.57 130.77,121.57 129.5,120.3 R65.2 129.38,120.43 128.11,121.7 124.68,121.7 124.3,121.31 119.98,121.31 118.96,120.3 R66.2 117.06,118.39 117.06,114.2 116.3,113.44 IC12.42 116.17,112.55 116.04,112.42 116.04,102.77 117.57,101.25 117.57,98.45 | 117.57,98.45 IC12.27 | v153.38,100.11 153.38,103.41 152.74,104.04 152.74,106.58 v145.38,113.95 | v136.23,119.03 135.98,119.28 135.98,121.57 | v144.49,91.22 144.62,91.34 | 124.17,76.87 125.82,76.87 v126.33,76.36 126.35,76.38 129.27,76.38 | 124.17,76.87 123.15,75.85 C12.1 123.03,76.23 123.03,75.72 122.14,74.83 115.28,74.83 106.26,65.82 v106.26,65.56 106.14,65.94 93.31,65.94 92.67,66.58 83.78,66.58 | 85.31,103.66 92.67,103.66 96.86,99.47 98.77,99.47 | 85.31,103.66 83.53,105.44 83.53,106.33 E-STOP.1 | 98.77,99.47 IC12.16 105.63,99.47 v106.26,98.84 | 85.31,103.66 83.53,101.88 83.53,97.95 Z-MAX.1 83.53,97.69 83.53,88.55 Z-MIN.1 83.66,88.3 83.66,79.28 Y-MAX.1 83.78,79.02 83.78,70.26 Y-MIN.1 83.78,70.01 83.78,66.58 | v84.42,28.61 84.42,26.95 R8.1 | v81.75,38.64 83.66,38.64 84.16,38.13 R82.2 | R6.1 98.39,49.81 97.75,49.81 95.47,47.53 93.69,47.53 R7.1 93.56,47.4 92.93,47.4 92.8,47.27 87.59,47.27 | 83.78,66.58 83.78,61.24 X-MAX.1 83.78,60.99 83.78,52.1 X-MIN.1 83.78,51.85 83.78,51.08 87.59,47.27 | 87.59,47.27 v87.34,47.02 | 117.57,98.45 v117.44,98.45 | v77.81,68.48 64.61,68.48 64.48,68.61 | v177,121.44 177,120.3 R50.2 | v161.51,117.5 v148.3,117.5 | C62.1 171.16,57.05 171.29,57.05 | C33.2 220.18,87.03 220.25,86.96 | 199.61,55.27 200.5,54.39
  Top 0.406: C49.2 235.42,71.66 235.42,71.53 | 221.83,96.5 C63.1 | C69.1 98.77,99.34 98.77,99.47 | 47.08,47.78 C19.2 | 124.17,76.87 124.17,78.08 v124.19,78.11 | IC24.6 121.15,84 v119.22,84 R105.2
  Bottom 0.406: v166.71,68.61 v166.71,62.01 | v166.97,58.83 v163.41,55.27 | v158.33,92.23 155.92,94.64 155.92,100.74 157.06,101.88 158.33,101.88 161,99.22 v166.08,99.22 169.25,99.22 171.79,101.76 172.53,101.76 173.78,103 | v236.56,98.71 236.56,100.77 239.41,102.7 239.41,106.35 v236.31,108.74 | v228.31,99.85 230.27,97.08 235.34,97.08 v236.56,98.71 | JP3.4 256.12,56.8 241.39,71.53 JP5.3 | JP1.1 241.26,78.26 244.56,81.56 244.56,92.99 241.77,95.79 239.23,95.79 236.56,98.45 v236.56,98.71 | v211.55,43.08 224.75,43.08 229.58,47.91 229.58,50.96 ICSP2.2 | ICSP1.2 51.65,96.93 48.86,99.72 48.86,105.57 | 48.86,105.57 48.86,106.2 43.91,111.16 X8.1 | v35.02,101.76 35.02,103.15 34.63,103.53 34.63,105.82 33.74,106.71 33.74,109.12 JP6.4 | v56.99,101.12 52.54,105.57 48.86,105.57 | v63.34,91.22 v58.64,95.92 | v153.38,100.11 v144.49,91.22 | v136.23,119.03 141.31,113.95 v145.38,113.95 144.87,114.08 v148.3,117.5 | v134.08,80.67 130.77,77.37 127.34,77.37 v126.33,76.36 | v106.26,65.56 ICSP.2 | v84.42,28.61 84.42,31.4 81.75,34.07 v81.75,38.64 81.75,41.43 v87.34,47.02 | v117.44,98.45 112.82,98.45 111.7,97.64 107.25,97.64 v106.26,98.84 | v77.81,68.48 82.01,68.48 83.66,70.13 Y-MIN.1 | v177,121.44 165.44,121.44 v161.51,117.5 | 173.78,103 176.11,105.34 v176.11,106.53 | v177.25,100.16 176.62,100.16 173.78,103 | v124.19,78.11 124.19,78.92 v119.22,84
A0
  Top 0.203: IC2.97 136.56,88.3 135.88,88.98 123.89,88.98 122.67,87.76 116.57,87.76 113.53,90.81 106.74,90.81 A-AXIS.4
A0/6  (via drill 0.51)
  Top 0.203: 39.4,76.67 40.09,77.37 44.92,77.37 45.05,77.25 IC11.3 | 39.4,76.67 39.21,76.48 39.21,75.85 40.73,74.33 R9.1 | IC14.23 41.75,101.38 40.6,101.38 40.6,100.74 v40.48,100.61 | 39.4,76.67 v37.17,78.64
  Bottom 0.203: v37.17,78.64 37.17,81.06 39.21,83.09 39.21,87.66 40.48,88.8 40.48,89.95 44.16,93.76 44.16,94.64 43.27,95.53 41.24,95.53 40.86,95.15 39.84,95.15 38.95,96.04 38.95,97.06 40.6,98.71 44.41,98.71 44.79,99.09 44.79,100.11 44.29,100.61 v40.48,100.61
A0/7  (via drill 0.51)
  Top 0.203: 229.96,76.48 R78.1 | IC7.23 227.93,76.23 229.71,76.23 229.96,76.48 | 229.96,76.48 v229.96,77.12 | v226.28,81.06 IC3.3
  Bottom 0.203: v229.96,77.12 v226.28,81.06
A1
  Top 0.203: A-AXIS.3 104.56,85.7 103.06,84.21 100.52,84.21 99.81,84.92 99.81,88.88 102.25,91.32 113.73,91.32 116.68,88.37 122.47,88.37 123.59,89.49 135.98,89.49 137.1,88.37 137.1,81.73 IC2.96
A1/6  (via drill 0.51)
  Top 0.203: IC11.2 45.05,78.52 44.92,78.39 40.73,78.39 R4.1 40.73,79.41 v39.59,80.55 | v44.54,103.03 43.91,102.39 41.87,102.39 IC14.24
  Bottom 0.203: v44.54,103.03 44.54,102.52 49.37,97.8 49.87,97.8 50.25,97.31 50.25,96.55 49.75,96.04 47.71,96.04 47.33,95.66 46.57,95.66 44.79,93.88 44.79,93.5 40.98,89.69 40.98,83.98 39.59,82.58 v39.59,80.55
A1/7  (via drill 0.51)
  Top 0.203: v220.94,80.93 215.99,75.98 R28.1 | v224.5,81.06 225.01,81.94 IC3.2 | v226.53,77.12 226.66,76.99 227.8,76.99 IC7.24
  Bottom 0.203: 222.72,80.93 223.99,80.93 v224.5,81.06 | v220.94,80.93 222.72,80.93 | 222.72,80.93 v226.53,77.12
A2  (via drill 0.6)
  Top 0.203: IC2.95 137.56,88.62 136.18,90 122.87,90 v122.26,89.39 | v117.59,86.03 107.15,86.03 A-AXIS.5
  Bottom 0.203: v122.26,89.39 120.94,89.39 v117.59,86.03
A2/6  (via drill 0.51)
  Top 0.203: v41.37,103.53 41.24,103.66 40.48,103.66 IC14.25 | v35.52,108.49 33.11,108.49 JP6.6
  Bottom 0.203: v41.37,103.53 39.59,103.53 35.52,107.6 v35.52,108.49
A2/7  (via drill 0.51)
  Top 0.203: IC7.25 226.53,78.39 228.44,78.39 228.82,78.01 233.39,78.01 v233.52,77.88
  Bottom 0.203: v233.52,77.88 234.84,77.88 236.18,76.23 240.88,76.33 258.66,58.45 JP3.6
A3  (via drill 0.51)
  Top 0.203: v165.83,88.3 165.7,88.42 164.81,88.42 IC20.6 | R11.1 138.77,85.88 138.39,85.5 v138.39,83.98 138.06,83.64 IC2.94
  Bottom 0.203: v165.83,88.3 165.83,86.01 160.11,80.29 160.11,79.53 157.95,77.37 155.79,77.37 155.16,78.01 147.16,78.01 146.65,77.5 144.36,77.5 138.39,83.47 v138.39,83.98
A3/6  (via drill 0.51)
  Top 0.203: v39.59,101.5 39.59,103.66 IC14.26 | v32.86,106.2 34.96,106.2 v35.27,106.51
  Bottom 0.203: v39.59,101.5 38.32,101.5 35.52,104.3 35.52,106.26 v35.27,106.51 | v32.86,106.2 30.06,109 30.06,110.52 JP6.5
A3/7  (via drill 0.51)
  Top 0.203: IC7.26 225.64,78.52 225.64,79.02 226.02,79.53 228.18,79.53 229.2,78.52 230.98,78.52 231.23,78.77 237.2,78.77 238.09,77.88 v238.09,77.12
  Bottom 0.203: v238.09,77.12 238.19,76.92 241.49,76.92 260.31,58.2 260.31,47.91 JP3.5
A4  (via drill 0.51)
  Top 0.203: v155.79,83.34 160.24,83.34 | 160.24,83.34 165.7,83.34 v165.83,82.96 | R12.1 141.82,85.88 141.82,85.5 v142.58,83.89 141.75,83.9 139.54,83.9 138.56,82.92 IC2.93 | v168.62,89.56 170.02,89.56 170.4,89.18 170.4,88.68 170.14,88.42 169.76,88.42 IC19.6 | 160.24,83.34 v160.24,83.98
  Bottom 0.203: v155.79,83.34 150.97,83.34 146.14,78.52 144.87,78.52 142.58,80.8 v142.58,83.89 | v168.62,89.56 165.83,89.56 v160.24,83.98
A5  (via drill 0.6 pad 0)
  Top 0.203: IC24.1 124.23,83.42 v123.89,83.09 | v132.02,84.61 129.17,81.77 124.4,81.77 v123.89,81.26 | v138.42,79.53 138.42,79.73 139.13,80.45 139.13,81.62 IC2.92
  Bottom 0.203: v123.89,81.26 v123.89,83.09 | v132.02,84.61 133.34,84.61 v138.42,79.53
A6  (via drill 0.6 pad 0)
  Top 0.203: v125.41,83.39 125.41,85.42 124.77,86.07 IC24.3 124.23,87.12 v123.89,87.46 | v125.41,80.85 127.24,80.85 127.65,81.26 130.29,81.26 v132.12,83.09 | v139.03,78.21 139.13,78.21 139.64,78.72 139.64,81.61 IC2.91 | v119.11,85.53 118.61,85.53 118.1,85.02 116.98,85.02 116.68,85.32 114.85,85.32 114.34,84.81 114.34,84.02 R105.1
  Bottom 0.203: v125.41,83.39 v125.41,80.85 | v132.12,83.09 133.75,83.09 136.89,79.94 136.89,79.43 138.11,78.21 v139.03,78.21 | v123.89,87.46 121.05,87.46 v119.11,85.53
A6/6  (via drill 0.51)
  Top 0.203: v51.91,90.71 49.24,93.38 48.73,93.38 44.92,97.19 43.65,97.19 42.63,98.2 41.87,98.2 IC14.19
  Bottom 0.203: v51.91,90.71 51.91,85.12 59.53,77.5 64.73,77.5 JP7.6
A6/7  (via drill 0.51)
  Top 0.203: v226.53,73.06 227.8,73.06 IC7.19
  Bottom 0.203: v226.53,73.06 227.93,73.06 229.02,73.79 238.65,73.79 JP5.6
A7/6  (via drill 0.51)
  Top 0.203: v64.99,94.39 58.13,94.39 56.99,93.25 55.59,93.25 55.08,93.76 55.08,94.52 55.34,94.77 55.34,101.63 53.94,103.03 45.94,103.03 43.65,100.74 41.87,100.74 IC14.22
  Bottom 0.203: v64.99,94.39 65.62,94.39 75.4,84.61 75.4,82.07 JP7.5
A7/7  (via drill 0.51)
  Top 0.203: v230.85,75.21 230.59,75.47 227.93,75.47 IC7.22
  Bottom 0.203: v230.85,75.21 237.25,75.21 237.89,75.75 239.74,75.75 JP5.5
A/3  (via drill 0.71)
  Top 0.61: 255.36,96.68 262.34,96.68 262.73,96.3 | 255.36,96.68 R31.1 | 262.73,96.3 X5.1 | v224.63,112.42 225.77,112.42 IC8.6 | v255.36,97.06 255.36,96.68 | 262.73,96.3 268.44,96.3 271.62,99.47 271.62,100.92 IC21.3
  Bottom 0.61: v224.63,112.42 241.52,112.42 245.58,108.36 250.79,108.36 251.42,107.73 251.42,106.33 249.52,104.42 249.52,102.9 v255.36,97.06
A/4  (via drill 0.71)
  Top 0.61: v161.76,97.69 159.22,100.23 159.22,109 162.65,112.42 165.83,112.42 IC10.6 | v191.86,95.92 192.88,96.93 R47.1 194.91,95.03 200.12,95.03 201.26,96.17 202.78,96.17 X6.1 208.78,96.2 211.8,99.22 211.8,100.92 IC22.3
  Bottom 0.61: v161.76,97.69 164.17,95.28 179.29,95.28 180.18,94.39 190.34,94.39 v191.86,95.92
A/5  (via drill 0.71)
  Top 0.61: IC23.3 151.98,100.92 151.98,99.09 149.09,96.2 X7.1 142.71,96.3 141.31,96.3 140.3,97.31 R63.1 136.11,97.06 134.84,95.79 132.3,95.79 v128.87,99.22 | v107.15,114.58 106.52,113.95 106.52,113.06 106.14,112.68 IC12.6
  Bottom 0.61: v107.15,114.58 108.93,114.58 110.15,113.36 112.41,113.36 116.02,109.76 119.72,109.76 128.36,101.12 128.36,99.72 v128.87,99.22
APWR  (via drill 0.6 pad 0, 0.71)
  Top 0.61: v54.83,110.39 53.3,110.39 DSA.C | v60.29,112.93 60.92,113.57 60.92,116.36
  Bottom 0.61: v54.83,110.39 57.75,110.39 v60.29,112.93 | X10.8 45.56,130.97 51.27,125.25 51.4,125.25
  other vias: 62.32,126.01 61.05,126.01 59.78,126.01 58.51,126.01 57.24,126.01 55.97,126.01 54.7,126.01 53.43,126.01 52.16,126.01 52.16,124.74 53.43,124.74 54.7,124.74 55.97,124.74 57.24,124.74 58.51,124.74 59.78,124.74 61.05,124.74 62.32,124.74 62.32,123.47 61.05,123.47 59.78,123.47 58.51,123.47 57.24,123.47 55.97,123.47 54.7,123.47 53.43,123.47 52.16,123.47 52.16,122.2 53.43,122.2 54.7,122.2 55.97,122.2 57.24,122.2 58.51,122.2 59.78,122.2 61.05,122.2 62.32,122.2 62.32,120.93 61.05,120.93 59.78,120.93 58.51,120.93 57.24,120.93 55.97,120.93 54.7,120.93 53.43,120.93 52.16,120.93 52.16,119.66 53.43,119.66 61.05,119.66 62.32,119.66 62.32,118.39 61.05,118.39 53.43,118.39 52.16,118.39 52.16,117.12 53.43,117.12 61.05,117.12 62.32,117.12
  pour Bottom (no thermals): 51.4,126.78 63.08,126.78 63.08,116.36 51.4,116.36
  pour Top (no thermals): 51.4,126.78 63.08,126.78 63.08,116.36 51.4,116.36
APWR1  (via drill 0.6 pad 0)
  Top 0.61: 229.45,34.57 DSD.C
  Bottom 0.61: X12.8 244.18,19.08 239.1,24.16
  other vias: 228.18,24.92 229.45,24.92 230.72,24.92 231.99,24.92 233.26,24.92 234.53,24.92 235.8,24.92 237.07,24.92 238.34,24.92 228.18,26.19 228.18,27.46 228.18,28.73 228.18,30 228.18,31.27 228.18,32.54 228.18,33.81 229.45,33.81 229.45,32.54 229.45,31.27 229.45,30 229.45,28.73 229.45,27.46 229.45,26.19 230.72,26.19 231.99,26.19 233.26,26.19 234.53,26.19 235.8,26.19 237.07,26.19 238.34,26.19 238.34,27.46 238.34,28.73 238.34,30 238.34,31.27 238.34,32.54 238.34,33.81 237.07,33.81 237.07,32.54 237.07,31.27 237.07,30 237.07,28.73 237.07,27.46 235.8,27.46 234.53,27.46 233.26,27.46 231.99,27.46 230.72,27.46 230.72,28.73 231.99,28.73 233.26,28.73 234.53,28.73 235.8,28.73 235.8,30 234.53,30 233.26,30 231.99,30 230.72,30
  pour Bottom (no thermals): 239.1,24.16 227.42,24.16 227.42,34.57 239.1,34.57
  pour Top (no thermals): 239.1,24.16 227.42,24.16 227.42,34.57 239.1,34.57
AREF
  Top 0.203: IC2.98 136.06,85.21 C4.1
ATGND  (via drill 0.51, 0.6 pad 0)
  Top 0.203: 29.43,123.08 29.43,125.76
  other vias: 33.87,124.44 26.12,121.82
  pour Bottom (rank 4): 26,121.7 26,128.43 32.98,135.41 43.02,135.41 43.02,130.33 34.89,121.7
  pour Top (rank 4): 26,121.7 26,129.06 32.6,135.41 43.02,135.41 43.02,130.33 34.89,121.7
ATGND1  (via drill 0.6 pad 0)
  other vias: 258.31,31.48
  pour Bottom (rank 4): 247.74,15.22 247.74,22.13 255.87,30.26 255.87,33.51 258.31,35.95 265.62,35.95 267.65,33.91 267.65,26.6 257.09,15.22
  pour Top (rank 4): 247.74,15.22 247.74,22.13 255.87,30.26 255.87,33.51 258.31,35.95 265.62,35.95 267.65,33.91 267.65,26.6 257.09,15.22
ATX_5V
  Top 0.406: X1.6 45.56,31.14 43.14,28.73 43.14,25.43 F3.1 43.14,25.3 45.68,22.76 48.35,22.76 53.81,28.22 53.81,31.14 X1.4
  Bottom 0.406: R3.2 77.81,51.08 75.96,51.08 63.77,38.89 56.6,38.89 55.84,38.13 55.84,33.3 53.81,31.27 X1.4
  Bottom 0.508: 23.97,39.02 26.25,39.02 28.54,36.73 X1.20 28.79,36.73 32.73,36.73 X1.19 32.98,36.61 33.49,36.61 36.67,33.43 43.02,33.43 45.17,31.27 X1.6 45.56,31.27
B/3  (via drill 0.71)
  Top 0.61: LED2.C 253.71,103.53 253.71,100.87 LED3.A 262.09,100.87 262.73,100.23 | X5.2 262.73,100.23 | v243.17,112.42 238.47,112.42 IC8.40 | 262.73,100.23 268.89,100.23 IC21.1
  Bottom 0.61: v243.17,112.42 249.52,112.42 261.71,100.23 262.73,100.23 X5.2
B/4  (via drill 0.71)
  Top 0.61: v183.73,112.42 178.53,112.42 IC10.40 | v194.53,105.57 195.8,104.3 LED1.C LED6.A 201.89,101.12 202.78,100.23 X6.2 209,100.16 IC22.1
  Bottom 0.61: v183.73,112.42 187.67,112.42 v194.53,105.57
B/5  (via drill 0.71)
  Top 0.61: 136.11,102.65 136.11,101.12 LED10.A 141.82,101.12 142.71,100.23 X7.2 149.19,100.16 IC23.1 | 136.11,102.65 136.11,104.04 LED9.C | v120.11,112.04 119.6,112.55 118.84,112.55 IC12.40 | v124.68,106.84 125.06,106.46 v127.98,106.46 | v135.47,102.65 136.11,102.65
  Bottom 0.61: v120.11,112.04 120.11,111.41 v124.68,106.84 | v127.98,106.46 131.66,106.46 v135.47,102.65
BPWR  (via drill 0.6, 0.71)
  Top 0.61: v66.89,111.28 66.13,110.52 DSB.C | v72.48,112.93 73.12,113.57 73.12,116.36
  Bottom 0.61: v66.89,111.28 70.83,111.28 v72.48,112.93 | X10.6 56.6,131.98 60.41,128.17 63.72,128.17 64.99,126.9 64.99,126.78
  other vias: 64.35,126.01 65.62,126.01 66.89,126.01 68.16,126.01 69.43,126.01 70.7,126.01 71.97,126.01 73.24,126.01 74.51,126.01 74.51,124.74 73.24,124.74 71.97,124.74 70.7,124.74 69.43,124.74 68.16,124.74 66.89,124.74 65.62,124.74 64.35,124.74 64.35,123.47 65.62,123.47 66.89,123.47 68.16,123.47 69.43,123.47 70.7,123.47 71.97,123.47 73.24,123.47 74.51,123.47 74.51,122.2 73.24,122.2 71.97,122.2 70.7,122.2 69.43,122.2 68.16,122.2 66.89,122.2 65.62,122.2 64.35,122.2 64.35,120.93 65.62,120.93 66.89,120.93 68.16,120.93 69.43,120.93 70.7,120.93 71.97,120.93 73.24,120.93 74.51,120.93 64.35,119.66 65.62,119.66 64.35,118.39 65.62,118.39 64.35,117.12 65.62,117.12 73.24,119.66 74.51,119.66 74.51,118.39 73.24,118.39 73.24,117.12 74.51,117.12
  pour Top (no thermals): 63.59,126.78 75.27,126.78 75.27,116.36 63.59,116.36
  pour Bottom (no thermals): 63.59,126.78 75.27,126.78 75.27,116.36 63.59,116.36
BPWR1  (via drill 0.6 pad 0)
  Top 0.61: 216.75,34.57 DSE.C
  Bottom 0.61: X12.6 231.61,22.26 228.82,22.26 226.91,24.16
  other vias: 215.99,24.92 215.99,26.19 215.99,27.46 215.99,28.73 215.99,30 215.99,31.27 215.99,32.54 215.99,33.81 217.26,33.81 217.26,32.54 217.26,31.27 217.26,30 217.26,28.73 217.26,27.46 217.26,26.19 217.26,24.92 218.53,24.92 219.8,24.92 221.07,24.92 222.34,24.92 223.61,24.92 224.88,24.92 226.15,24.92 226.15,26.19 224.88,26.19 223.61,26.19 222.34,26.19 221.07,26.19 219.8,26.19 218.53,26.19 218.53,27.46 219.8,27.46 221.07,27.46 222.34,27.46 223.61,27.46 224.88,27.46 226.15,27.46 226.15,28.73 224.88,28.73 223.61,28.73 222.34,28.73 221.07,28.73 219.8,28.73 218.53,28.73 218.53,30 219.8,30 221.07,30 222.34,30 223.61,30 224.88,30 226.15,30 226.15,31.27 226.15,32.54 226.15,33.81 224.88,33.81 224.88,32.54 224.88,31.27
  pour Bottom (no thermals): 226.91,24.16 215.23,24.16 215.23,34.57 226.91,34.57
  pour Top (no thermals): 226.91,24.16 215.23,24.16 215.23,34.57 226.91,34.57
C/3  (via drill 0.71)
  Top 0.61: v226.15,94.39 226.15,95.92 225.77,96.3 IC8.18 | v242.91,92.36 245.84,95.28 245.84,99.47 247.36,101 LED4.C 247.61,101 247.61,103.66 LED5.A 247.74,103.92 249.26,105.44 259.93,105.44 261.2,104.17 262.73,104.17 X5.3 268.82,104.12 IC21.6
  Bottom 0.61: v226.15,94.39 240.88,94.39 v242.91,92.36
C/4  (via drill 0.71)
  Top 0.61: 188.3,102.52 188.3,103.92 LED8.A | 188.3,102.52 188.3,101 LED7.C | v188.94,102.52 188.3,102.52 | v164.68,96.42 165.83,96.42 IC10.18 | X6.3 209,104.12 IC22.6
  Bottom 0.61: X6.3 202.78,104.04 201.26,104.04 199.73,102.52 v188.94,102.52 188.69,102.39 181.57,95.28 180.56,95.28 179.41,96.42 v164.68,96.42
C/5  (via drill 0.71)
  Top 0.61: v104.99,96.55 106.14,96.55 IC12.18 | v126.2,100.87 127.22,100.87 LED11.C LED12.A 127.34,104.17 129,105.82 137,105.82 138.77,104.04 142.71,104.04 X7.3 149.19,104.12 IC23.6
  Bottom 0.61: v104.99,96.55 121.88,96.55 v126.2,100.87
CMP
  Top 0.203: IC18.3 62.19,47.91 62.95,47.15 67.74,47.15 R26.2 | R26.2 C18.2 | R26.2 68.67,48.58 R19.1
CPWR  (via drill 0.6, 0.71)
  Top 0.61: v80.1,110.52 DSC.C | v84.67,112.93 85.31,113.57 85.31,116.36 | X10.4 66.77,131.98 70.58,128.17 75.91,128.17 77.18,126.9 77.18,126.78
  Bottom 0.61: v80.1,110.52 82.26,110.52 v84.67,112.93
  other vias: 76.54,126.01 77.81,126.01 79.08,126.01 80.35,126.01 81.62,126.01 82.89,126.01 84.16,126.01 85.43,126.01 86.7,126.01 86.7,124.74 85.43,124.74 84.16,124.74 82.89,124.74 81.62,124.74 80.35,124.74 79.08,124.74 77.81,124.74 76.54,124.74 76.54,123.47 77.81,123.47 79.08,123.47 80.35,123.47 81.62,123.47 82.89,123.47 84.16,123.47 85.43,123.47 86.7,123.47 86.7,122.2 85.43,122.2 84.16,122.2 82.89,122.2 81.62,122.2 80.35,122.2 79.08,122.2 77.81,122.2 76.54,122.2 76.54,120.93 77.81,120.93 79.08,120.93 80.35,120.93 81.62,120.93 82.89,120.93 84.16,120.93 85.43,120.93 86.7,120.93 76.54,119.66 77.81,119.66 77.81,118.39 77.81,117.12 76.54,117.12 76.54,118.39 85.43,119.66 85.43,118.39 85.43,117.12 86.7,119.66 86.7,118.39 86.7,117.12
  pour Bottom (no thermals): 75.78,126.78 87.47,126.78 87.47,116.36 75.78,116.36
  pour Top (no thermals): 75.78,126.78 87.47,126.78 87.47,116.36 75.78,116.36
CPWR1  (via drill 0.6 pad 0)
  Top 0.61: 203.29,34.57 DSF.C
  Bottom 0.61: X12.4 221.45,22.26 216.62,22.26 214.72,24.16
  other vias: 208.88,24.92 207.61,24.92 206.34,24.92 205.07,24.92 203.8,24.92 210.15,24.92 211.42,24.92 212.69,24.92 213.96,24.92 203.8,26.19 203.8,27.46 203.8,28.73 203.8,30 203.8,31.27 203.8,32.54 203.8,33.81 205.07,33.81 205.07,32.54 205.07,31.27 205.07,30 205.07,28.73 205.07,27.46 205.07,26.19 213.96,26.19 213.96,27.46 213.96,28.73 213.96,30 213.96,31.27 213.96,32.54 213.96,33.81 212.69,33.81 212.69,32.54 212.69,31.27 212.69,30 212.69,28.73 212.69,27.46 212.69,26.19 206.34,26.19 207.61,26.19 208.88,26.19 210.15,26.19 211.42,26.19 211.42,27.46 210.15,27.46 208.88,27.46 207.61,27.46 206.34,27.46 206.34,28.73 207.61,28.73 208.88,28.73 210.15,28.73 211.42,28.73 211.42,30 210.15,30 208.88,30 207.61,30 206.34,30
  pour Bottom (no thermals): 214.72,24.16 203.04,24.16 203.04,34.57 214.72,34.57
  pour Top (no thermals): 214.72,24.16 203.04,24.16 203.04,34.57 214.72,34.57
CTS
  Top 0.203: X3.1 201.77,77.5 199.73,77.5 197.83,75.59 192.75,75.59 IC6.11
D0  (via drill 0.6, 0.6 pad 0)
  Top 0.203: v130.9,79.79 131.5,79.19 IC2.2 | v130.39,90.96 132.42,90.96 133.69,92.23 134.05,92.23 134.46,92.64 139.74,92.64 140.15,92.23 149.7,92.23 150.2,92.74 156.1,92.74 IC15.4
  Bottom 0.203: v130.9,79.79 130.9,89.95 v130.39,90.96
D1  (via drill 0.6, 0.6 pad 0)
  Top 0.203: v129.38,79.79 130.47,78.69 IC2.3 | v126.33,91.83 127.14,92.64 133.44,92.64 133.85,93.05 140.15,93.05 140.55,92.64 149.49,92.64 150,93.15 163.51,93.15 166.71,89.95 166.71,88.42 167.22,87.91 167.6,87.91 IC20.2 167.66,87.97
  Bottom 0.203: v126.33,91.83 126.33,82.83 v129.38,79.79
D2  (via drill 0.6)
  Top 0.203: IC2.6 133,77.25 126.58,77.25 124.8,79.02 123.38,79.02 123.13,78.77 v120.99,78.77 | TP1.TP 92.47,107.74 E-STOP.4
  Bottom 0.203: E-STOP.4 91.14,105.83 103.98,92.99 106.77,92.99 v120.99,78.77
D2/6
  Top 0.203: X8.3 44.16,116.23 45.94,114.46 45.94,111.41 44.54,110.01 40.6,110.01 35.9,105.31 35.65,105.31 34.76,104.42 34.76,103.79 IC14.32
D2/7  (via drill 0.51)
  Top 0.203: v217.77,76.48 217.77,77.12 219.04,78.39 220.69,78.39 IC7.32 | v233.39,58.96 233.39,58.45 246.6,45.24 X11.3
  Bottom 0.203: v217.77,76.48 231.61,62.64 232.63,62.64 233.39,61.88 v233.39,58.96
D3/6  (via drill 0.51)
  Top 0.203: v29.3,107.22 33.24,103.28 33.24,102.39 IC14.1 | v37.3,116.62 40.22,116.62 42.38,118.78 X8.4
  Bottom 0.203: v29.3,107.22 29.3,108.49 29.05,108.74 29.05,115.35 30.32,116.62 v37.3,116.62
D3/7  (via drill 0.51)
  Top 0.203: v221.71,76.99 219.42,76.99 IC7.1
  Bottom 0.203: X11.4 245.33,49.69 245.33,52.73 225.77,72.29 225.77,72.42 225.52,72.67 225.52,73.56 224.63,74.45 223.86,74.45 221.71,76.61 v221.71,76.99
D4
  Top 0.203: B-AXIS.3 104.47,72.53 103.2,73.8 103.2,75.6 109,81.4 121.62,81.4 122.98,79.94 127.75,79.94 128.56,80.85 132.12,80.85 133,79.77 133,79.7 IC2.1
D4/6  (via drill 0.51)
  Top 0.203: 28.92,117 28.92,119.03 28.79,119.16 IC17.6 | 28.92,117 R88.1 | v27.65,106.46 32.6,101.5 33.24,101.5 IC14.2 | v27.65,115.73 28.92,117
  Bottom 0.203: v27.65,106.46 v27.65,115.73
D4/7  (via drill 0.51)
  Top 0.203: 263.11,42.96 263.11,39.02 262.85,38.77 IC9.6 | v257.65,50.83 258.41,50.83 263.11,46.13 263.11,42.96 | 219.42,76.23 IC7.2 219.35,76.23 220.31,76.23 220.69,75.85 220.69,75.72 222.97,75.72 v223.48,76.1 | 263.11,42.96 R97.1
  Bottom 0.203: v223.48,76.1 224.63,76.1 226.43,74.33 237.4,74.33 238.27,75.34 239.43,75.34 240.15,74.53 240.15,73.51 240.83,72.62 242.05,72.65 257.9,56.67 257.9,51.08 v257.65,50.83
D5
  Top 0.203: B-AXIS.4 109.47,80.04 121.5,80.04 122.16,79.48 125.46,79.48 127.15,77.69 IC2.5